# Altium schematic sheet Toplevel.SchDoc
size A4
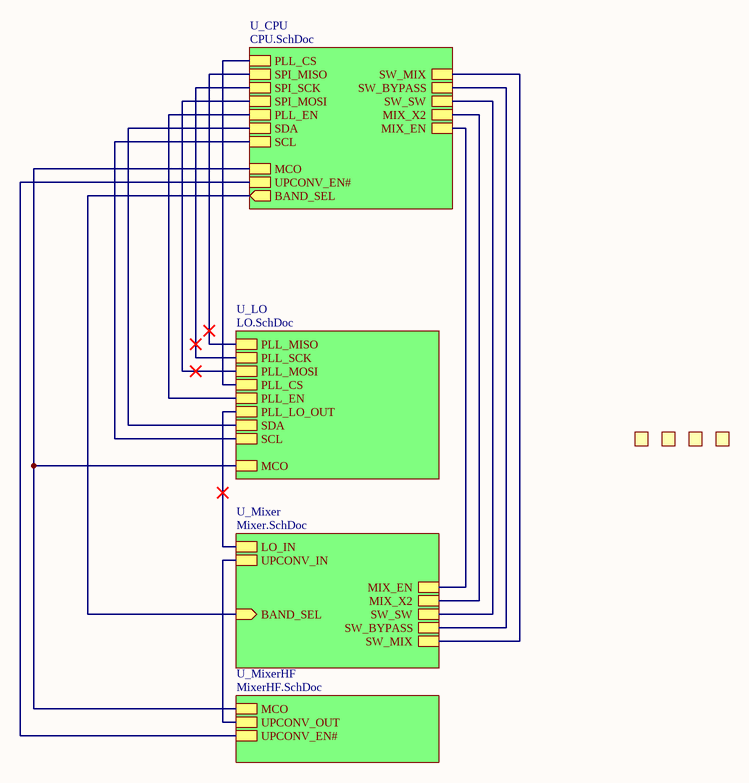
[diagram p0: Toplevel.SchDoc]

## Parts
H1  MOUNTHOLE_3MM  [MOUNT_3MM]  (value not drawn)
H2  MOUNTHOLE_3MM  [MOUNT_3MM]  (value not drawn)
H3  MOUNTHOLE_3MM  [MOUNT_3MM]  (value not drawn)
H4  MOUNTHOLE_3MM  [MOUNT_3MM]  (value not drawn)

## Sub-sheets
U_CPU = CPU.SchDoc: PLL_CS, SPI_MISO, SPI_SCK, SPI_MOSI, PLL_EN, SDA, SCL, MCO, UPCONV_EN#, SW_MIX, SW_BYPASS, SW_SW, MIX_X2, MIX_EN, BAND_SEL (out)
U_LO = LO.SchDoc: PLL_MISO, PLL_SCK, PLL_MOSI, PLL_CS, PLL_EN, PLL_LO_OUT, SDA, SCL, MCO
U_Mixer = Mixer.SchDoc: LO_IN, UPCONV_IN, MIX_EN, MIX_X2, SW_SW, SW_BYPASS, SW_MIX, BAND_SEL (in)
U_MixerHF = MixerHF.SchDoc: MCO, UPCONV_OUT, UPCONV_EN#

## Nets
(unnamed): sheet U_CPU/PLL_CS, sheet U_LO/PLL_CS
(unnamed): sheet U_CPU/SPI_MISO, sheet U_LO/PLL_MISO
(unnamed): sheet U_CPU/SPI_SCK, sheet U_LO/PLL_SCK
(unnamed): sheet U_CPU/SPI_MOSI, sheet U_LO/PLL_MOSI
(unnamed): sheet U_CPU/PLL_EN, sheet U_LO/PLL_EN
(unnamed): sheet U_CPU/SDA, sheet U_LO/SDA
(unnamed): sheet U_CPU/SCL, sheet U_LO/SCL
(unnamed): sheet U_CPU/MCO, sheet U_MixerHF/MCO, sheet U_LO/MCO
(unnamed): sheet U_CPU/UPCONV_EN#, sheet U_MixerHF/UPCONV_EN#
(unnamed): sheet U_CPU/SW_MIX, sheet U_Mixer/SW_MIX
(unnamed): sheet U_CPU/SW_BYPASS, sheet U_Mixer/SW_BYPASS
(unnamed): sheet U_CPU/SW_SW, sheet U_Mixer/SW_SW
(unnamed): sheet U_CPU/MIX_X2, sheet U_Mixer/MIX_X2
(unnamed): sheet U_CPU/MIX_EN, sheet U_Mixer/MIX_EN
(unnamed): sheet U_CPU/BAND_SEL, sheet U_Mixer/BAND_SEL
(unnamed): sheet U_Mixer/LO_IN, sheet U_LO/PLL_LO_OUT
(unnamed): sheet U_Mixer/UPCONV_IN, sheet U_MixerHF/UPCONV_OUT